# EAGLE schematic bitfury_m-board-v2.3 (EAGLE 6.3)

## Sheet 1 of 2
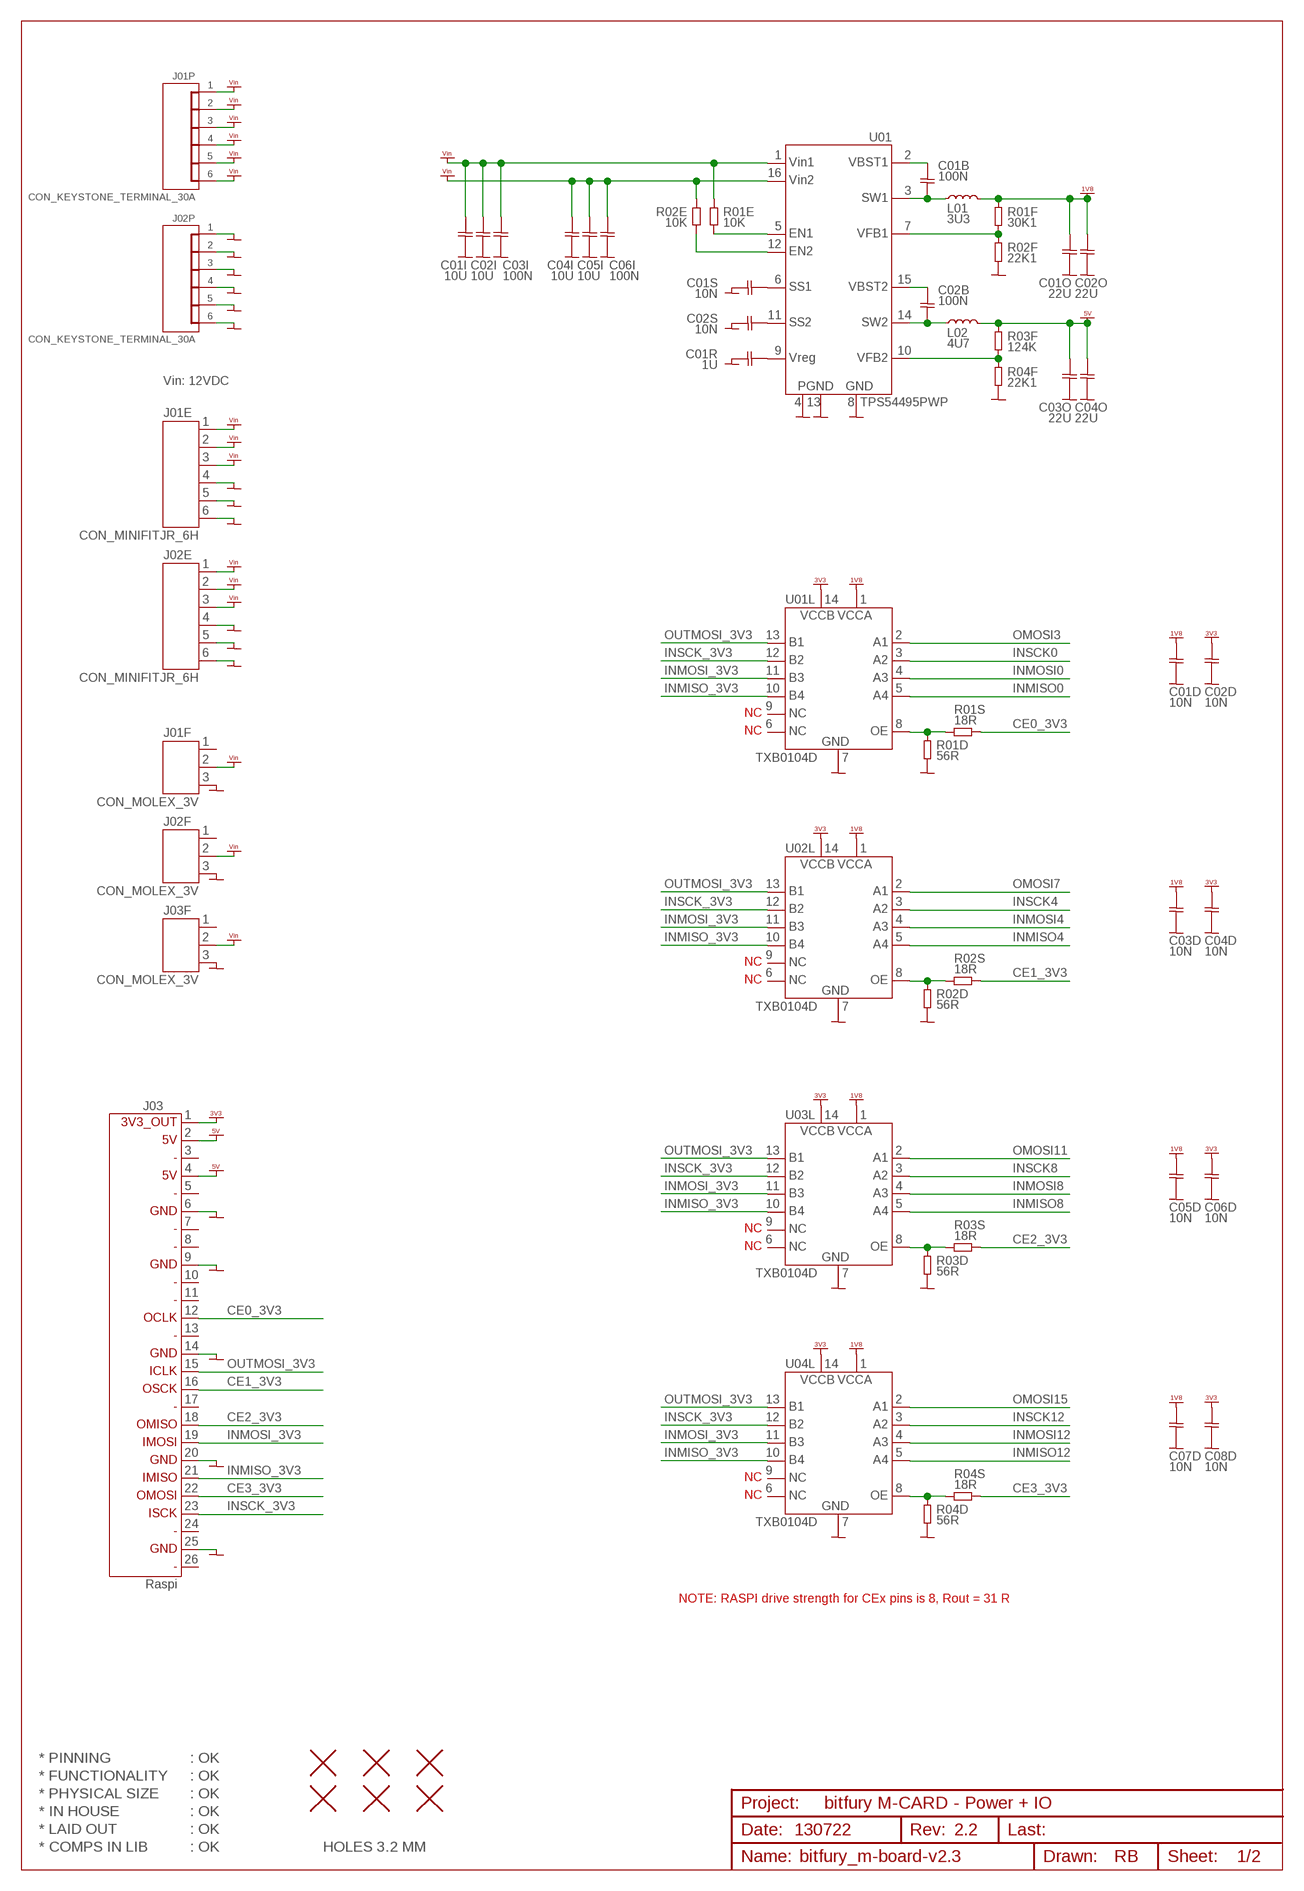
[diagram p0: schematic, sheet 1]

### Parts
C01B  100N  CAP0603  [CAP0603]
C01D  10N  CAP0603  [CAP0603]
C01I  10U  CAP1206  [CAP1206]
C01O  22U  CAP1206  [CAP1206]
C01R  1U  CAP0603  [CAP0603]
C01S  10N  CAP0603  [CAP0603]
C02B  100N  CAP0603  [CAP0603]
C02D  10N  CAP0603  [CAP0603]
C02I  10U  CAP1206  [CAP1206]
C02O  22U  CAP1206  [CAP1206]
C02S  10N  CAP0603  [CAP0603]
C03D  10N  CAP0603  [CAP0603]
C03I  100N  CAP0603  [CAP0603]
C03O  22U  CAP1206  [CAP1206]
C04D  10N  CAP0603  [CAP0603]
C04I  10U  CAP1206  [CAP1206]
C04O  22U  CAP1206  [CAP1206]
C05D  10N  CAP0603  [CAP0603]
C05I  10U  CAP1206  [CAP1206]
C06D  10N  CAP0603  [CAP0603]
C06I  100N  CAP0603  [CAP0603]
C07D  10N  CAP0603  [CAP0603]
C08D  10N  CAP0603  [CAP0603]
H01  HOLE_NPTH_3.2MM  [HOLE_NPTH_3.2MM]
H02  HOLE_NPTH_3.2MM  [HOLE_NPTH_3.2MM]
H03  HOLE_NPTH_3.2MM  [HOLE_NPTH_3.2MM]
H04  HOLE_NPTH_3.2MM  [HOLE_NPTH_3.2MM]
H05  HOLE_NPTH_3.2MM  [HOLE_NPTH_3.2MM]
H06  HOLE_NPTH_3.2MM  [HOLE_NPTH_3.2MM]
J01E  CON_MINIFITJR_6H  CON_MOLEX_MINIFITJR_6H  [CON_MOLEX_MINIFITJR_6H]
J01F  CON_MOLEX_3V  [CON_MOLEX_3V]
J01P  CON_KEYSTONE_TERMINAL_30A  [CON_KEYSTONE_TERMINAL_30A]
J02E  CON_MINIFITJR_6H  CON_MOLEX_MINIFITJR_6H  [CON_MOLEX_MINIFITJR_6H]
J02F  CON_MOLEX_3V  [CON_MOLEX_3V]
J02P  CON_KEYSTONE_TERMINAL_30A  [CON_KEYSTONE_TERMINAL_30A]
J03  Raspi  CON_RASPI_ANGLE  [CON_RASPI_ANGLE]
J03F  CON_MOLEX_3V  [CON_MOLEX_3V]
L01  3U3  L_SPM6530  [L_SPM6530]
L02  4U7  L_SPM6530  [L_SPM6530]
R01D  56R  RES0603  [RES0603]
R01E  10K  RES0603  [RES0603]
R01F  30K1  RES0603  [RES0603]
R01S  18R  RES0603  [RES0603]
R02D  56R  RES0603  [RES0603]
R02E  10K  RES0603  [RES0603]
R02F  22K1  RES0603  [RES0603]
R02S  18R  RES0603  [RES0603]
R03D  56R  RES0603  [RES0603]
R03F  124K  RES0603  [RES0603]
R03S  18R  RES0603  [RES0603]
R04D  56R  RES0603  [RES0603]
R04F  22K1  RES0603  [RES0603]
R04S  18R  RES0603  [RES0603]
U01  TPS54495PWP  [HTSSOP16]
U01L  TXB0104D  [SO14]
U02L  TXB0104D  [SO14]
U03L  TXB0104D  [SO14]
U04L  TXB0104D  [SO14]

### Nets
CE0_3V3: J03.12 R01S.2
CE1_3V3: J03.16 R02S.2
CE2_3V3: J03.18 R03S.2
CE3_3V3: J03.22 R04S.2
GND: C01D.2 C01I.2 C01O.2 C01R.1 C01S.1 C02D.2 C02I.2 C02O.2 C02S.1 C03D.2 C03I.2 C03O.2 C04D.2 C04I.2 C04O.2 C05D.2 C05I.2 C06D.2 C06I.2 C07D.2 C08D.2 J01E.4 J01E.5 J01E.6 J01F.3 J02E.4 J02E.5 J02E.6 J02F.3 J02P.1 J02P.2 J02P.3 J02P.4 J02P.5 J02P.6 J03.6 J03.9 J03.14 J03.20 J03.25 J03F.3 R01D.2 R02D.2 R02F.2 R03D.2 R04D.2 R04F.2 U01.4(4.PGND) U01.8(8.GND) U01.13(13.PGND) U01.EP(13.PGND) U01.P1(13.PGND) U01.P2(13.PGND) U01.P3(13.PGND) U01.P4(13.PGND) U01.P5(13.PGND) U01.P6(13.PGND) U01L.7(7.GND) U02L.7(7.GND) U03L.7(7.GND) U04L.7(7.GND) ; also sheet 2
INMISO0: U01L.5(5.A4) ; also sheet 2
INMISO4: U02L.5(5.A4) ; also sheet 2
INMISO8: U03L.5(5.A4) ; also sheet 2
INMISO12: U04L.5(5.A4) ; also sheet 2
INMISO_3V3: J03.21 U01L.10(10.B4) U02L.10(10.B4) U03L.10(10.B4) U04L.10(10.B4)
INMOSI0: U01L.4(4.A3) ; also sheet 2
INMOSI4: U02L.4(4.A3) ; also sheet 2
INMOSI8: U03L.4(4.A3) ; also sheet 2
INMOSI12: U04L.4(4.A3) ; also sheet 2
INMOSI_3V3: J03.19 U01L.11(11.B3) U02L.11(11.B3) U03L.11(11.B3) U04L.11(11.B3)
INSCK0: U01L.3(3.A2) ; also sheet 2
INSCK4: U02L.3(3.A2) ; also sheet 2
INSCK8: U03L.3(3.A2) ; also sheet 2
INSCK12: U04L.3(3.A2) ; also sheet 2
INSCK_3V3: J03.23 U01L.12(12.B2) U02L.12(12.B2) U03L.12(12.B2) U04L.12(12.B2)
N$1: R01F.2 R02F.1 U01.7(7.VFB1)
N$2: C01B.2 L01.1 U01.3(3.SW1)
N$3: R01D.1 R01S.1 U01L.8(8.OE)
N$4: C01B.1 U01.2(2.VBST1)
N$5: C02B.2 L02.1 U01.14(14.SW2)
N$6: C02B.1 U01.15(15.VBST2)
N$7: R03F.2 R04F.1 U01.10(10.VFB2)
N$8: C01S.2 U01.6(6.SS1)
N$9: C01R.2 U01.9(9.VREG)
N$10: C02S.2 U01.11(11.SS2)
N$11: R01E.2 U01.5(5.EN1)
N$12: R02E.2 U01.12(12.EN2)
N$13: R02D.1 R02S.1 U02L.8(8.OE)
N$14: R03D.1 R03S.1 U03L.8(8.OE)
N$15: R04D.1 R04S.1 U04L.8(8.OE)
OMOSI3: U01L.2(2.A1) ; also sheet 2
OMOSI7: U02L.2(2.A1) ; also sheet 2
OMOSI11: U03L.2(2.A1) ; also sheet 2
OMOSI15: U04L.2(2.A1) ; also sheet 2
OUTMOSI_3V3: J03.15 U01L.13(13.B1) U02L.13(13.B1) U03L.13(13.B1) U04L.13(13.B1)
VDD_1V8: C01D.1 C01O.1 C02O.1 C03D.1 C05D.1 C07D.1 L01.2 R01F.1 U01L.1(1.VCCA) U02L.1(1.VCCA) U03L.1(1.VCCA) U04L.1(1.VCCA) ; supply symbol labelled VCC_1V8 ; also sheet 2
VDD_3V3: C02D.1 C04D.1 C06D.1 C08D.1 J03.1 U01L.14(14.VDDB) U02L.14(14.VDDB) U03L.14(14.VDDB) U04L.14(14.VDDB) ; supply symbol labelled VCC_3V3
VDD_5V: C03O.1 C04O.1 J03.2 J03.4 L02.2 R03F.1 ; supply symbol labelled VCC_5V
VDD_POWER-IN: C01I.1 C02I.1 C03I.1 C04I.1 C05I.1 C06I.1 J01E.1 J01E.2 J01E.3 J01F.2 J01P.1 J01P.2 J01P.3 J01P.4 J01P.5 J01P.6 J02E.1 J02E.2 J02E.3 J02F.2 J03F.2 R01E.1 R02E.1 U01.1(1.VIN1) U01.16(16.VIN2) ; supply symbol labelled VCC_POWER-IN ; also sheet 2
Unconnected: J01F.1 J02F.1 J03.3 J03.5 J03.7 J03.8 J03.10 J03.11 J03.13 J03.17 J03.24 J03.26 J03F.1 U01L.6(6.NC) U01L.9(9.NC) U02L.6(6.NC) U02L.9(9.NC) U03L.6(6.NC) U03L.9(9.NC) U04L.6(6.NC) U04L.9(9.NC)

### Notes on the sheet
- Vin: 12VDC
- NC
- NC
- NC
- NC
- NC
- NC
- NC
- NC
- NOTE: RASPI drive strength for CEx pins is 8, Rout = 31 R
- * PINNING | : OK
- * FUNCTIONALITY | : OK
- * PHYSICAL SIZE | : OK
- bitfury M-CARD - Power + IO
- * IN HOUSE | : OK
- * LAID OUT | : OK | 130722 | 2.2
- * COMPS IN LIB | : OK | HOLES 3.2 MM

## Sheet 2 of 2
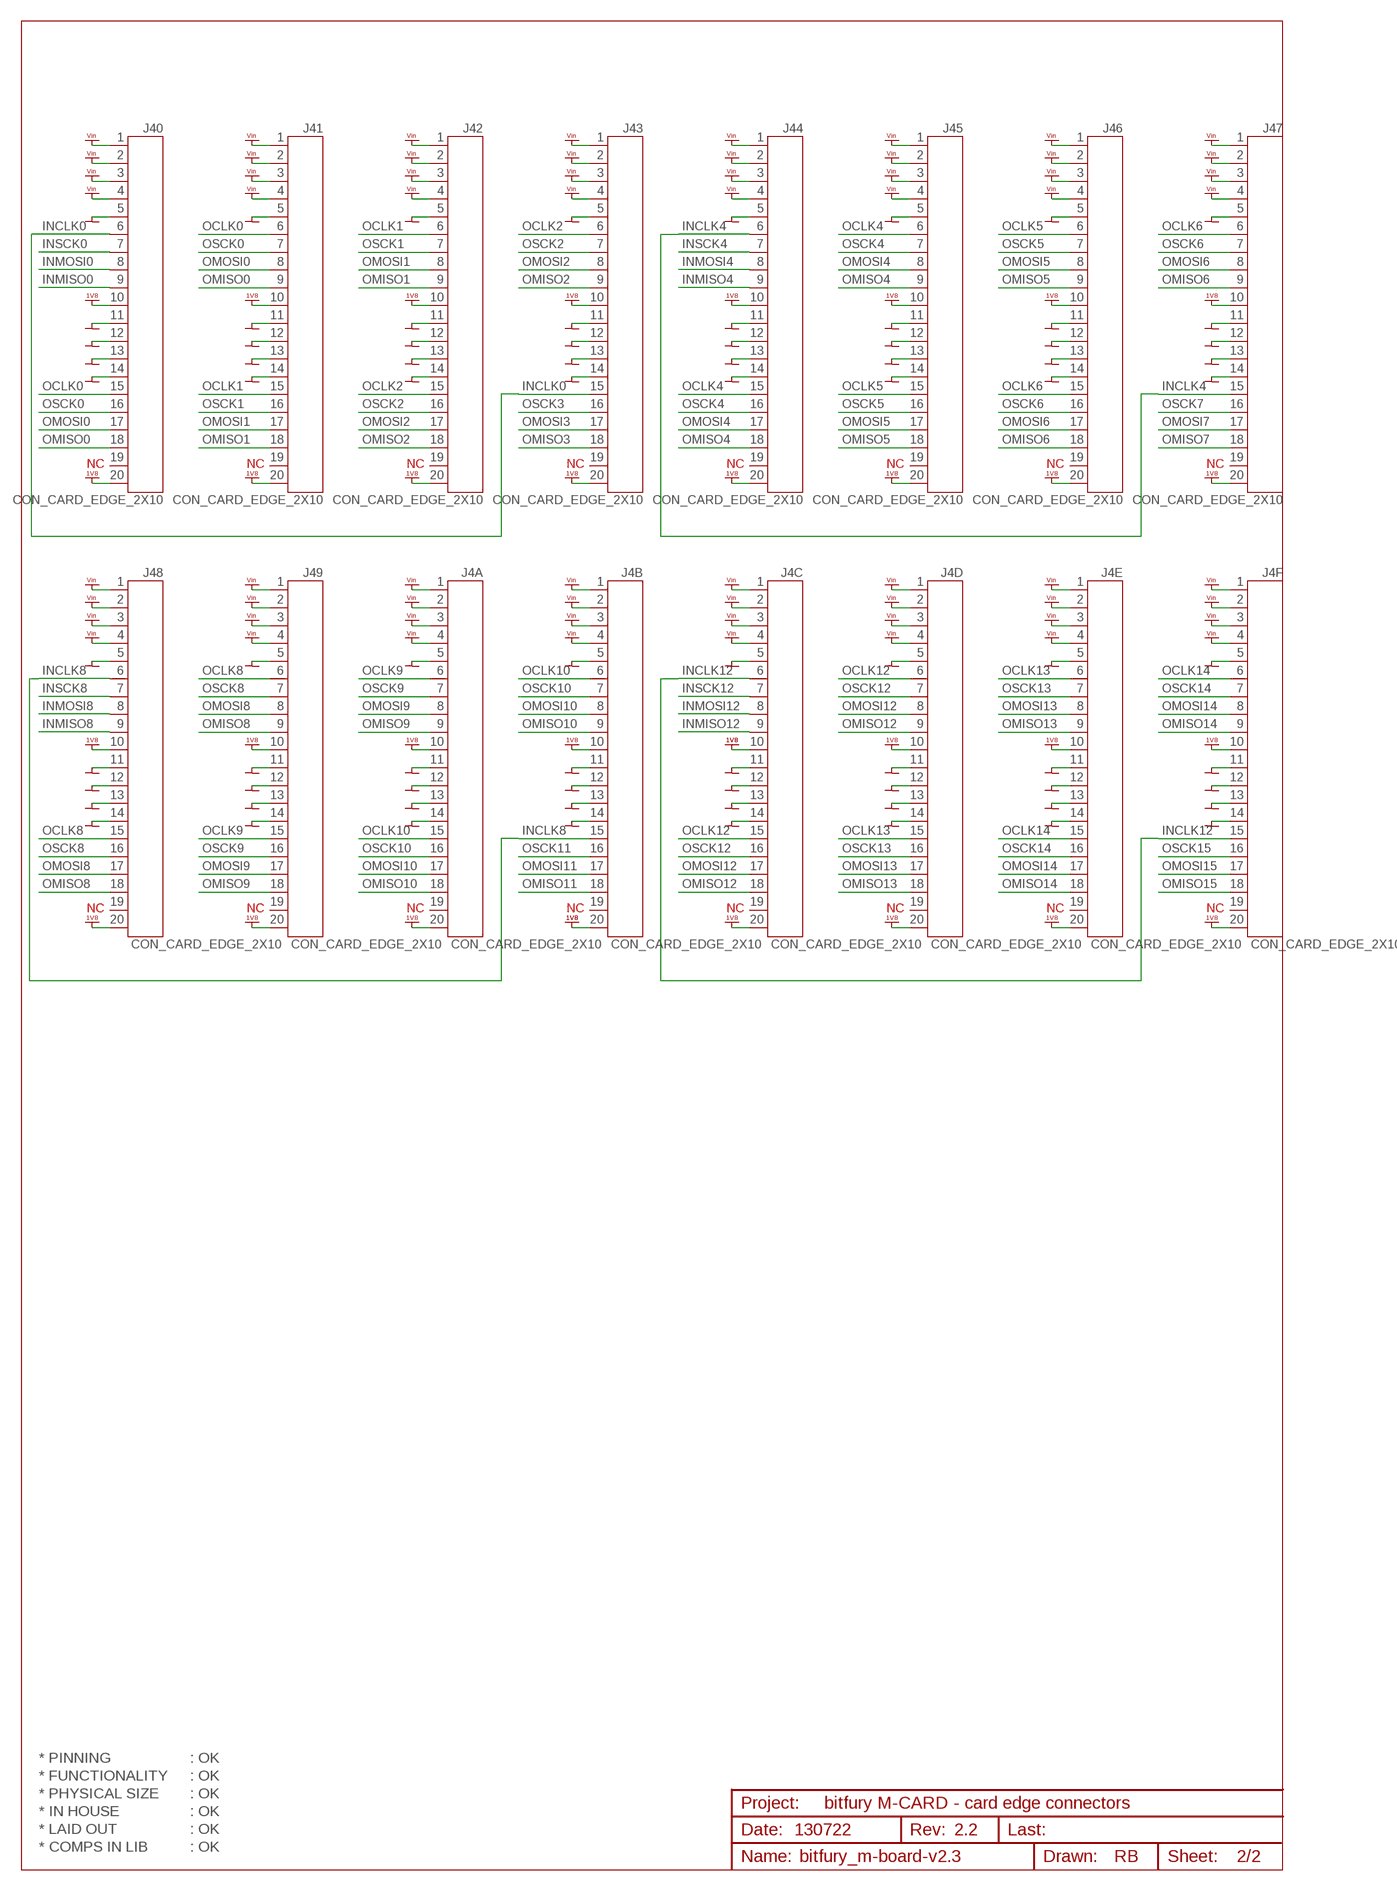
[diagram p1: schematic, sheet 2]

### Parts
J4A  CON_CARD_EDGE_2X10  [CON_CARD_EDGE_2X10]
J4B  CON_CARD_EDGE_2X10  [CON_CARD_EDGE_2X10]
J4C  CON_CARD_EDGE_2X10  [CON_CARD_EDGE_2X10]
J4D  CON_CARD_EDGE_2X10  [CON_CARD_EDGE_2X10]
J4E  CON_CARD_EDGE_2X10  [CON_CARD_EDGE_2X10]
J4F  CON_CARD_EDGE_2X10  [CON_CARD_EDGE_2X10]
J40  CON_CARD_EDGE_2X10  [CON_CARD_EDGE_2X10]
J41  CON_CARD_EDGE_2X10  [CON_CARD_EDGE_2X10]
J42  CON_CARD_EDGE_2X10  [CON_CARD_EDGE_2X10]
J43  CON_CARD_EDGE_2X10  [CON_CARD_EDGE_2X10]
J44  CON_CARD_EDGE_2X10  [CON_CARD_EDGE_2X10]
J45  CON_CARD_EDGE_2X10  [CON_CARD_EDGE_2X10]
J46  CON_CARD_EDGE_2X10  [CON_CARD_EDGE_2X10]
J47  CON_CARD_EDGE_2X10  [CON_CARD_EDGE_2X10]
J48  CON_CARD_EDGE_2X10  [CON_CARD_EDGE_2X10]
J49  CON_CARD_EDGE_2X10  [CON_CARD_EDGE_2X10]

### Nets
GND: J4A.5 J4A.11 J4A.12 J4A.13 J4A.14 J4B.5 J4B.11 J4B.12 J4B.13 J4B.14 J4C.5 J4C.11 J4C.12 J4C.13 J4C.14 J4D.5 J4D.11 J4D.12 J4D.13 J4D.14 J4E.5 J4E.11 J4E.12 J4E.13 J4E.14 J4F.5 J4F.11 J4F.12 J4F.13 J4F.14 J40.5 J40.11 J40.12 J40.13 J40.14 J41.5 J41.11 J41.12 J41.13 J41.14 J42.5 J42.11 J42.12 J42.13 J42.14 J43.5 J43.11 J43.12 J43.13 J43.14 J44.5 J44.11 J44.12 J44.13 J44.14 J45.5 J45.11 J45.12 J45.13 J45.14 J46.5 J46.11 J46.12 J46.13 J46.14 J47.5 J47.11 J47.12 J47.13 J47.14 J48.5 J48.11 J48.12 J48.13 J48.14 J49.5 J49.11 J49.12 J49.13 J49.14 ; also sheet 1
INCLK0: J40.6 J43.15
INCLK4: J44.6 J47.15
INCLK8: J4B.15 J48.6
INCLK12: J4C.6 J4F.15
INMISO0: J40.9 ; also sheet 1
INMISO4: J44.9 ; also sheet 1
INMISO8: J48.9 ; also sheet 1
INMISO12: J4C.9 ; also sheet 1
INMOSI0: J40.8 ; also sheet 1
INMOSI4: J44.8 ; also sheet 1
INMOSI8: J48.8 ; also sheet 1
INMOSI12: J4C.8 ; also sheet 1
INSCK0: J40.7 ; also sheet 1
INSCK4: J44.7 ; also sheet 1
INSCK8: J48.7 ; also sheet 1
INSCK12: J4C.7 ; also sheet 1
OCLK0: J40.15 J41.6
OCLK1: J41.15 J42.6
OCLK2: J42.15 J43.6
OCLK4: J44.15 J45.6
OCLK5: J45.15 J46.6
OCLK6: J46.15 J47.6
OCLK8: J48.15 J49.6
OCLK9: J4A.6 J49.15
OCLK10: J4A.15 J4B.6
OCLK12: J4C.15 J4D.6
OCLK13: J4D.15 J4E.6
OCLK14: J4E.15 J4F.6
OMISO0: J40.18 J41.9
OMISO1: J41.18 J42.9
OMISO2: J42.18 J43.9
OMISO3: J43.18
OMISO4: J44.18 J45.9
OMISO5: J45.18 J46.9
OMISO6: J46.18 J47.9
OMISO7: J47.18
OMISO8: J48.18 J49.9
OMISO9: J4A.9 J49.18
OMISO10: J4A.18 J4B.9
OMISO11: J4B.18
OMISO12: J4C.18 J4D.9
OMISO13: J4D.18 J4E.9
OMISO14: J4E.18 J4F.9
OMISO15: J4F.18
OMOSI0: J40.17 J41.8
OMOSI1: J41.17 J42.8
OMOSI2: J42.17 J43.8
OMOSI3: J43.17 ; also sheet 1
OMOSI4: J44.17 J45.8
OMOSI5: J45.17 J46.8
OMOSI6: J46.17 J47.8
OMOSI7: J47.17 ; also sheet 1
OMOSI8: J48.17 J49.8
OMOSI9: J4A.8 J49.17
OMOSI10: J4A.17 J4B.8
OMOSI11: J4B.17 ; also sheet 1
OMOSI12: J4C.17 J4D.8
OMOSI13: J4D.17 J4E.8
OMOSI14: J4E.17 J4F.8
OMOSI15: J4F.17 ; also sheet 1
OSCK0: J40.16 J41.7
OSCK1: J41.16 J42.7
OSCK2: J42.16 J43.7
OSCK3: J43.16
OSCK4: J44.16 J45.7
OSCK5: J45.16 J46.7
OSCK6: J46.16 J47.7
OSCK7: J47.16
OSCK8: J48.16 J49.7
OSCK9: J4A.7 J49.16
OSCK10: J4A.16 J4B.7
OSCK11: J4B.16
OSCK12: J4C.16 J4D.7
OSCK13: J4D.16 J4E.7
OSCK14: J4E.16 J4F.7
OSCK15: J4F.16
VDD_1V8: J4A.10 J4A.20 J4B.10 J4B.20 J4C.10 J4C.20 J4D.10 J4D.20 J4E.10 J4E.20 J4F.10 J4F.20 J40.10 J40.20 J41.10 J41.20 J42.10 J42.20 J43.10 J43.20 J44.10 J44.20 J45.10 J45.20 J46.10 J46.20 J47.10 J47.20 J48.10 J48.20 J49.10 J49.20 ; supply symbol labelled VCC_1V8 ; also sheet 1
VDD_POWER-IN: J4A.1 J4A.2 J4A.3 J4A.4 J4B.1 J4B.2 J4B.3 J4B.4 J4C.1 J4C.2 J4C.3 J4C.4 J4D.1 J4D.2 J4D.3 J4D.4 J4E.1 J4E.2 J4E.3 J4E.4 J4F.1 J4F.2 J4F.3 J4F.4 J40.1 J40.2 J40.3 J40.4 J41.1 J41.2 J41.3 J41.4 J42.1 J42.2 J42.3 J42.4 J43.1 J43.2 J43.3 J43.4 J44.1 J44.2 J44.3 J44.4 J45.1 J45.2 J45.3 J45.4 J46.1 J46.2 J46.3 J46.4 J47.1 J47.2 J47.3 J47.4 J48.1 J48.2 J48.3 J48.4 J49.1 J49.2 J49.3 J49.4 ; supply symbol labelled VCC_POWER-IN ; also sheet 1
Unconnected: J4A.19 J4B.19 J4C.19 J4D.19 J4E.19 J4F.19 J40.19 J41.19 J42.19 J43.19 J44.19 J45.19 J46.19 J47.19 J48.19 J49.19

### Notes on the sheet
- NC | NC | NC | NC | NC | NC | NC | NC
- NC | NC | NC | NC | NC | NC | NC | NC
- * PINNING | : OK
- * FUNCTIONALITY | : OK
- * PHYSICAL SIZE | : OK
- bitfury M-CARD - card edge connectors
- * IN HOUSE | : OK
- * LAID OUT | : OK | 130722 | 2.2
- * COMPS IN LIB | : OK

## Library data of the parts
C01B C01D C01R C01S C02B C02D C02S C03D C03I C04D C05D C06D C06I C07D C08D = 00-own_parts:CAP0603
C01I C01O C02I C02O C03O C04I C04O C05I = 00-own_parts:CAP1206
H01-H06 = 00-own_parts:HOLE_NPTH_3.2MM: Hole, NPTH, 3.2mm
J01E J02E = 00-own_parts:CON_MOLEX_MINIFITJR_6H: Connector, Molex, MINIFIT JUNIOR
J01F J02F J03F = 00-own_parts:CON_MOLEX_3V: Connector, Molex, header, straight, 0.1", 4p, F#973-1156
J01P J02P = 00-bitfury:CON_KEYSTONE_TERMINAL_30A: Connector, screw terminal 30 A, Keystone, 1 way, DK#8197k-ND / F#211-2487
J03 = 00-bitfury:CON_RASPI_ANGLE: Socket, 100mil header 2x13, Samtec ESQ-113-44-T-D, F# 193-0971
J4A J4B J4C J4D J4E J4F J40-J49 = 00-own_parts:CON_CARD_EDGE_2X10: Connector, card edge, 2x10, female, PCB, DK#: A29121-ND
L01 L02 = 00-bitfury:L_SPM6530: Inductor, case SPM6530, TDK
R01D R01E R01F R01S R02D R02E R02F R02S R03D R03F R03S R04D R04F R04S = 00-own_parts:RES
U01 = 00-bitfury:TPS54495PWP: DC/DC converter, switching, dual power: 0V7..7V/2A and 4A, HTSSOP16, F#221-1343
U01L U02L U03L U04L = 00-bitfury:TXB0104D: Level translator, bidirectional, SOIC14, DK#296-21928-1-ND